# EAGLE design etchasketch (EAGLE 9.6.2)
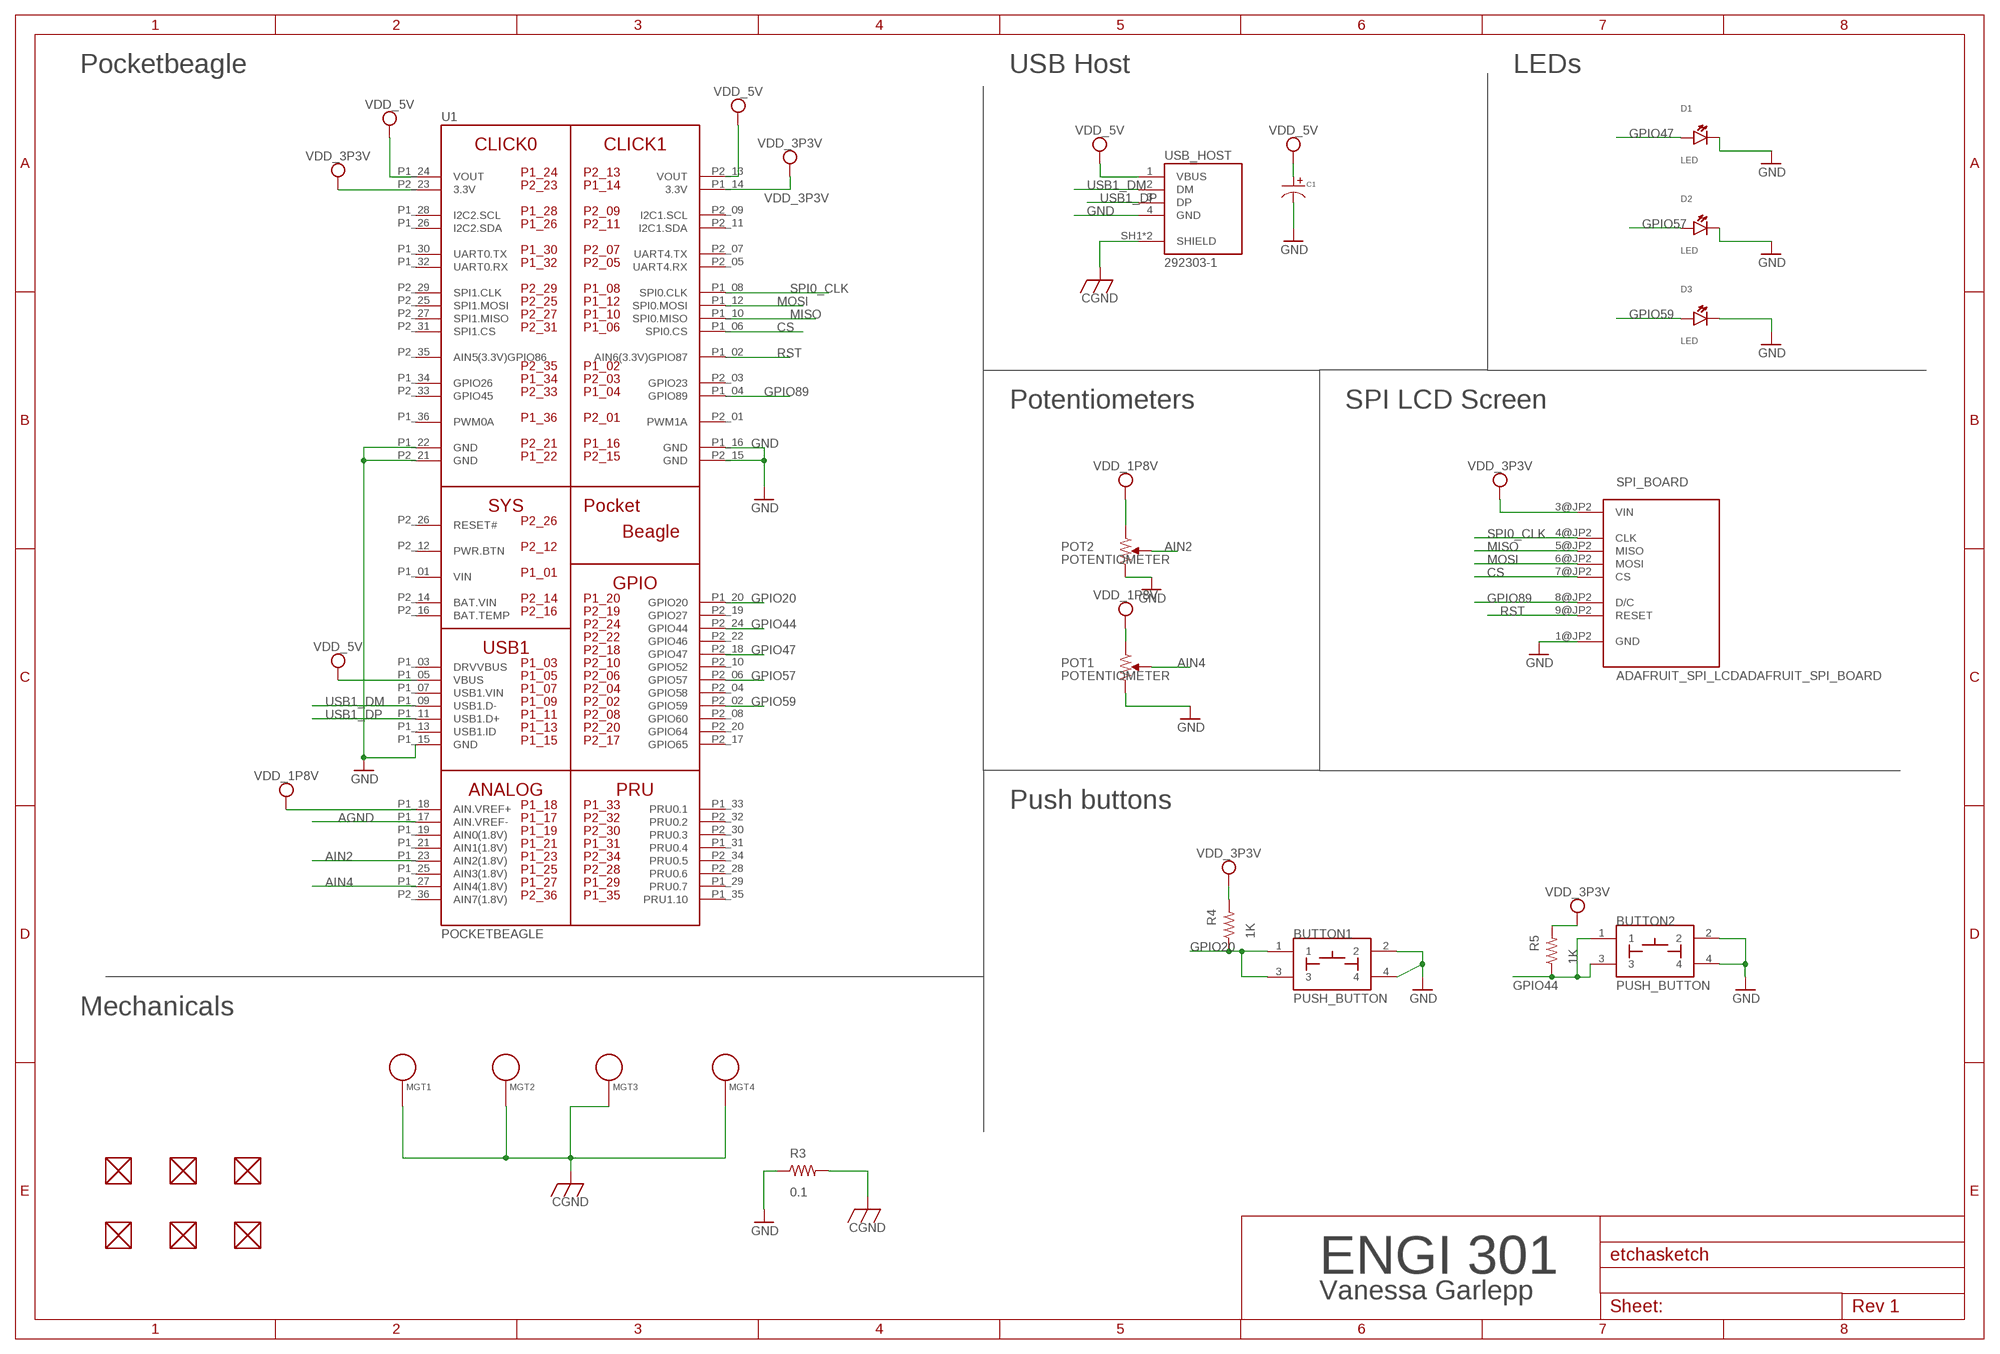
[diagram p0: schematic, sheet 1]

## Parts
BUTTON1  PUSH_BUTTON  [BUTTON_12.5MM]
BUTTON2  PUSH_BUTTON  [BUTTON_12.5MM]
C1  CAPACITOR_P_10MM  [CP10MM]
D1  LED  [EIA-STD]
D2  LED  [EIA-STD]
D3  LED  [EIA-STD]
FUD1  FIDUCIAL  [FIDUCIAL_40MIL]
FUD2  FIDUCIAL  [FIDUCIAL_40MIL]
FUD3  FIDUCIAL  [FIDUCIAL_40MIL]
FUD4  FIDUCIAL  [FIDUCIAL_40MIL]
FUD5  FIDUCIAL  [FIDUCIAL_40MIL]
FUD6  FIDUCIAL  [FIDUCIAL_40MIL]
MGT1  MOUNTING_HOLE  [MOUNTING_HOLE]
MGT2  MOUNTING_HOLE  [MOUNTING_HOLE]
MGT3  MOUNTING_HOLE  [MOUNTING_HOLE]
MGT4  MOUNTING_HOLE  [MOUNTING_HOLE]
POT1  POTENTIOMETER  [POT-PO90S]
POT2  POTENTIOMETER  [POT-PO90S]
R3  0.1  R_R0603  [R0603]
R4  1K  R_R0402  [R0402]
R5  1K  R_R0402  [R0402]
SPI_BOARD  ADAFRUIT_SPI_LCDADAFRUIT_SPI_BOARD  [ADAFRUIT_SPI_BOARD]
U1  POCKETBEAGLE  [POCKETBEAGLE]
USB_HOST  292303-1  [TE_292303-1]

## Nets
AGND: U1.P1_17(AIN.VREF-)
AIN2: POT2.S U1.P1_23(AIN2(1.8V))
AIN4: POT1.S U1.P1_27(AIN4(1.8V))
CGND [New Class]: MGT1.P$1 MGT2.P$1 MGT3.P$1 MGT4.P$1 R3.2 USB_HOST.SH1(SHIELD) USB_HOST.SH2(SHIELD)
CS: SPI_BOARD.7@JP2(CS) U1.P1_06(SPI0.CS)
GND: BUTTON1.2 BUTTON1.4 BUTTON2.2 BUTTON2.4 C1.P$2 D1.CATHODE D2.CATHODE D3.CATHODE POT1.CW POT2.CW R3.1 SPI_BOARD.1@JP2(GND) U1.P1_15(GND) U1.P1_16(GND) U1.P1_22(GND) U1.P2_15(GND) U1.P2_21(GND) USB_HOST.4(GND)
GPIO20: BUTTON1.1 BUTTON1.3 R4.1 U1.P1_20(GPIO20)
GPIO44: BUTTON2.1 BUTTON2.3 R5.1 U1.P2_24(GPIO44)
GPIO47: D1.ANODE U1.P2_18(GPIO47)
GPIO57: D2.ANODE U1.P2_06(GPIO57)
GPIO59: D3.ANODE U1.P2_02(GPIO59)
GPIO89: SPI_BOARD.8@JP2(D/C) U1.P1_04(GPIO89)
MISO: SPI_BOARD.5@JP2(MISO) U1.P1_10(SPI0.MISO)
MOSI: SPI_BOARD.6@JP2(MOSI) U1.P1_12(SPI0.MOSI)
RST: SPI_BOARD.9@JP2(RESET) U1.P1_02(AIN6(3.3V)GPIO87)
SPI0_CLK: SPI_BOARD.4@JP2(CLK) U1.P1_08(SPI0.CLK)
USB1_DM: U1.P1_09(USB1.D-) USB_HOST.2(DM)
USB1_DP: U1.P1_11(USB1.D+) USB_HOST.3(DP)
VDD_1P8V: POT1.CCW POT2.CCW U1.P1_18(AIN.VREF+)
VDD_3P3V: R4.2 R5.2 SPI_BOARD.3@JP2(VIN) U1.P1_14(3.3V) U1.P2_23(3.3V)
VDD_5V: C1.P$1 U1.P1_05(VBUS) U1.P1_24(VOUT) U1.P2_13(VOUT) USB_HOST.1(VBUS)
Unconnected: FUD1.P$1 FUD2.P$1 FUD3.P$1 FUD4.P$1 FUD5.P$1 FUD6.P$1 U1.P1_03(DRVVBUS) U1.P1_07(USB1.VIN) U1.P1_13(USB1.ID) U1.P1_19(AIN0(1.8V)) U1.P1_21(AIN1(1.8V)) U1.P1_25(AIN3(1.8V)) U1.P1_26(I2C2.SDA) U1.P1_28(I2C2.SCL) U1.P1_29(PRU0.7) U1.P1_30(UART0.TX) U1.P1_31(PRU0.4) U1.P1_32(UART0.RX) U1.P1_33(PRU0.1) U1.P1_34(GPIO26) U1.P1_35(PRU1.10) U1.P1_36(PWM0A) U1.P2_01(PWM1A) U1.P2_03(GPIO23) U1.P2_04(GPIO58) U1.P2_05(UART4.RX) U1.P2_07(UART4.TX) U1.P2_08(GPIO60) U1.P2_09(I2C1.SCL) U1.P2_10(GPIO52) U1.P2_11(I2C1.SDA) U1.P2_12(PWR.BTN) U1.P2_16(BAT.TEMP) U1.P2_17(GPIO65) U1.P2_19(GPIO27) U1.P2_20(GPIO64) U1.P2_22(GPIO46) U1.P2_25(SPI1.MOSI) U1.P2_26(RESET#) U1.P2_27(SPI1.MISO) U1.P2_28(PRU0.6) U1.P2_29(SPI1.CLK) U1.P2_30(PRU0.3) U1.P2_31(SPI1.CS) U1.P2_32(PRU0.2) U1.P2_33(GPIO45) U1.P2_34(PRU0.5) U1.P2_35(AIN5(3.3V)GPIO86) U1.P2_36(AIN7(1.8V))

## Notes on the sheet
- Pocketbeagle | USB Host | LEDs
- Potentiometers | SPI LCD Screen
- Push buttons
- Mechanicals
- ENGI 301
- Vanessa Garlepp

## Power pins joined to a net without a drawn wire
BAT.VIN: U1.P2_14(BAT.VIN)
VIN: U1.P1_01(VIN)

## Library data of the parts
BUTTON1 BUTTON2 = pcb_garlepp:PUSH_BUTTON
C1 = pcb_garlepp:CAPACITOR_P: Library: MF_Passives Description: Device for Polarized Capacitors. Manufacture part number (MPN), Voltage Rating, and Tolerance can be added via Attributes. Check https://factory.macrofab.com/parts for the house parts list.; POPULATE: 1
D1-D3 = pcb_garlepp:LED: EIA-STD LED, LTST-C191TBKT
FUD1-FUD6 = pcb_garlepp:FIDUCIAL
MGT1-MGT4 = pcb_garlepp:MOUNTING_HOLE: Chassis Mounting Hole w/GND connection ability
POT1 POT2 = pcb_garlepp:POTENTIOMETER: Potentiometer - Examples: P090S-14T20BR10K (987-1277-ND)
R3-R5 = pcb_garlepp:R_: RESISTOR, American symbol
SPI_BOARD = pcb_garlepp:ADAFRUIT_SPI_LCD: Adafruit 2.8" TFT SPI LCD Display: https://github.com/adafruit/2.8-TFT-Breakout-PCB
U1 = pcb_garlepp:POCKETBEAGLE
USB_HOST = pcb_garlepp:292303-1: CONN USB RECEPT R/A TYPE A 4POS Check availability <https://pricing.snapeda.com/parts/292303-1/TE%20Connectivity/view-part?ref=eda>; AVAILABILITY: In Stock; CENTERLINE_PITCH: 2 mm[.078 in]; COMMENT: 292303-1; DESCRIPTION: Conn; Data; USB; Recept; 2.0; 4 Pos; 1 Port; Rt Angle; A Ser; Tin over Copper; EU_ROHS_COMPLIANCE: Compliant; MF: TE Connectivity; MP: 292303-1; NUMBER_OF_POSITIONS: 4; PACKAGE: None; PRICE: None; PRODUCT_TYPE: Connector; PURCHASE-URL: https://pricing.snapeda.com/search/part/292303-1/?ref=eda

## Board
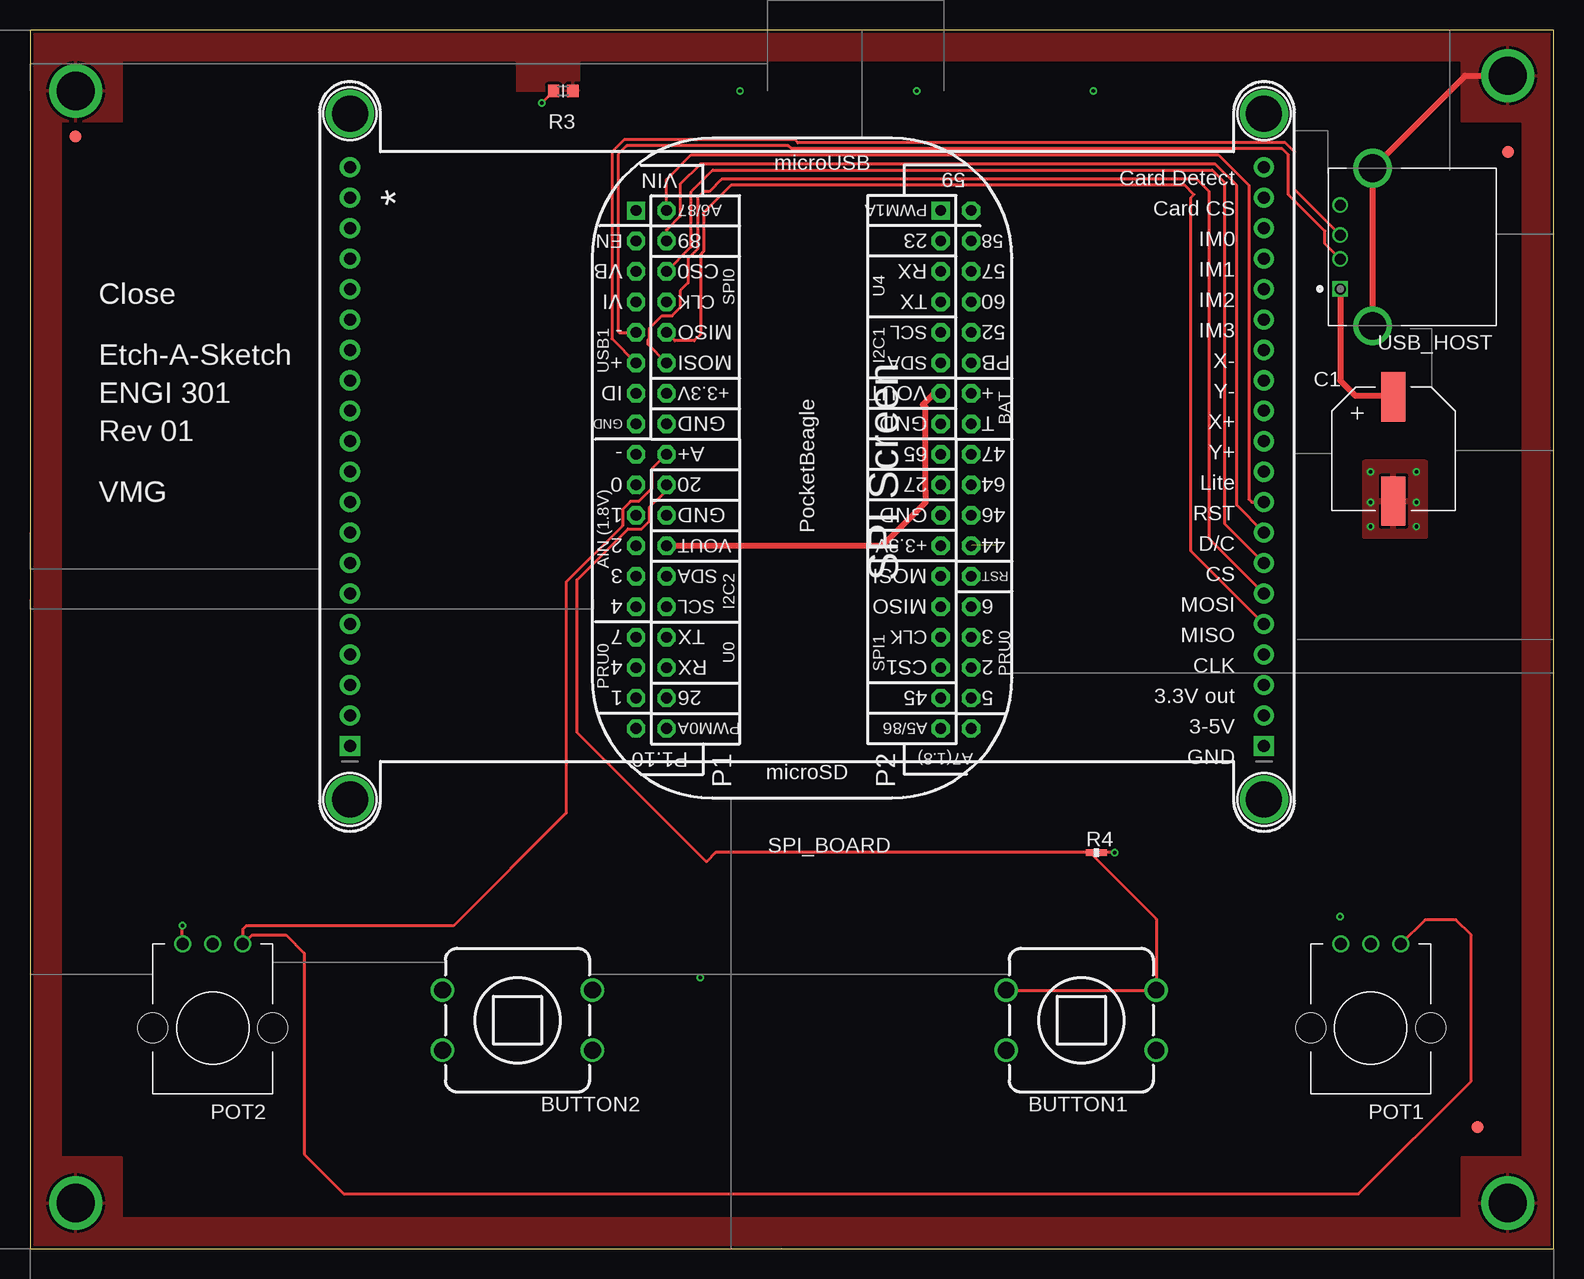
[diagram p1: board, top side]
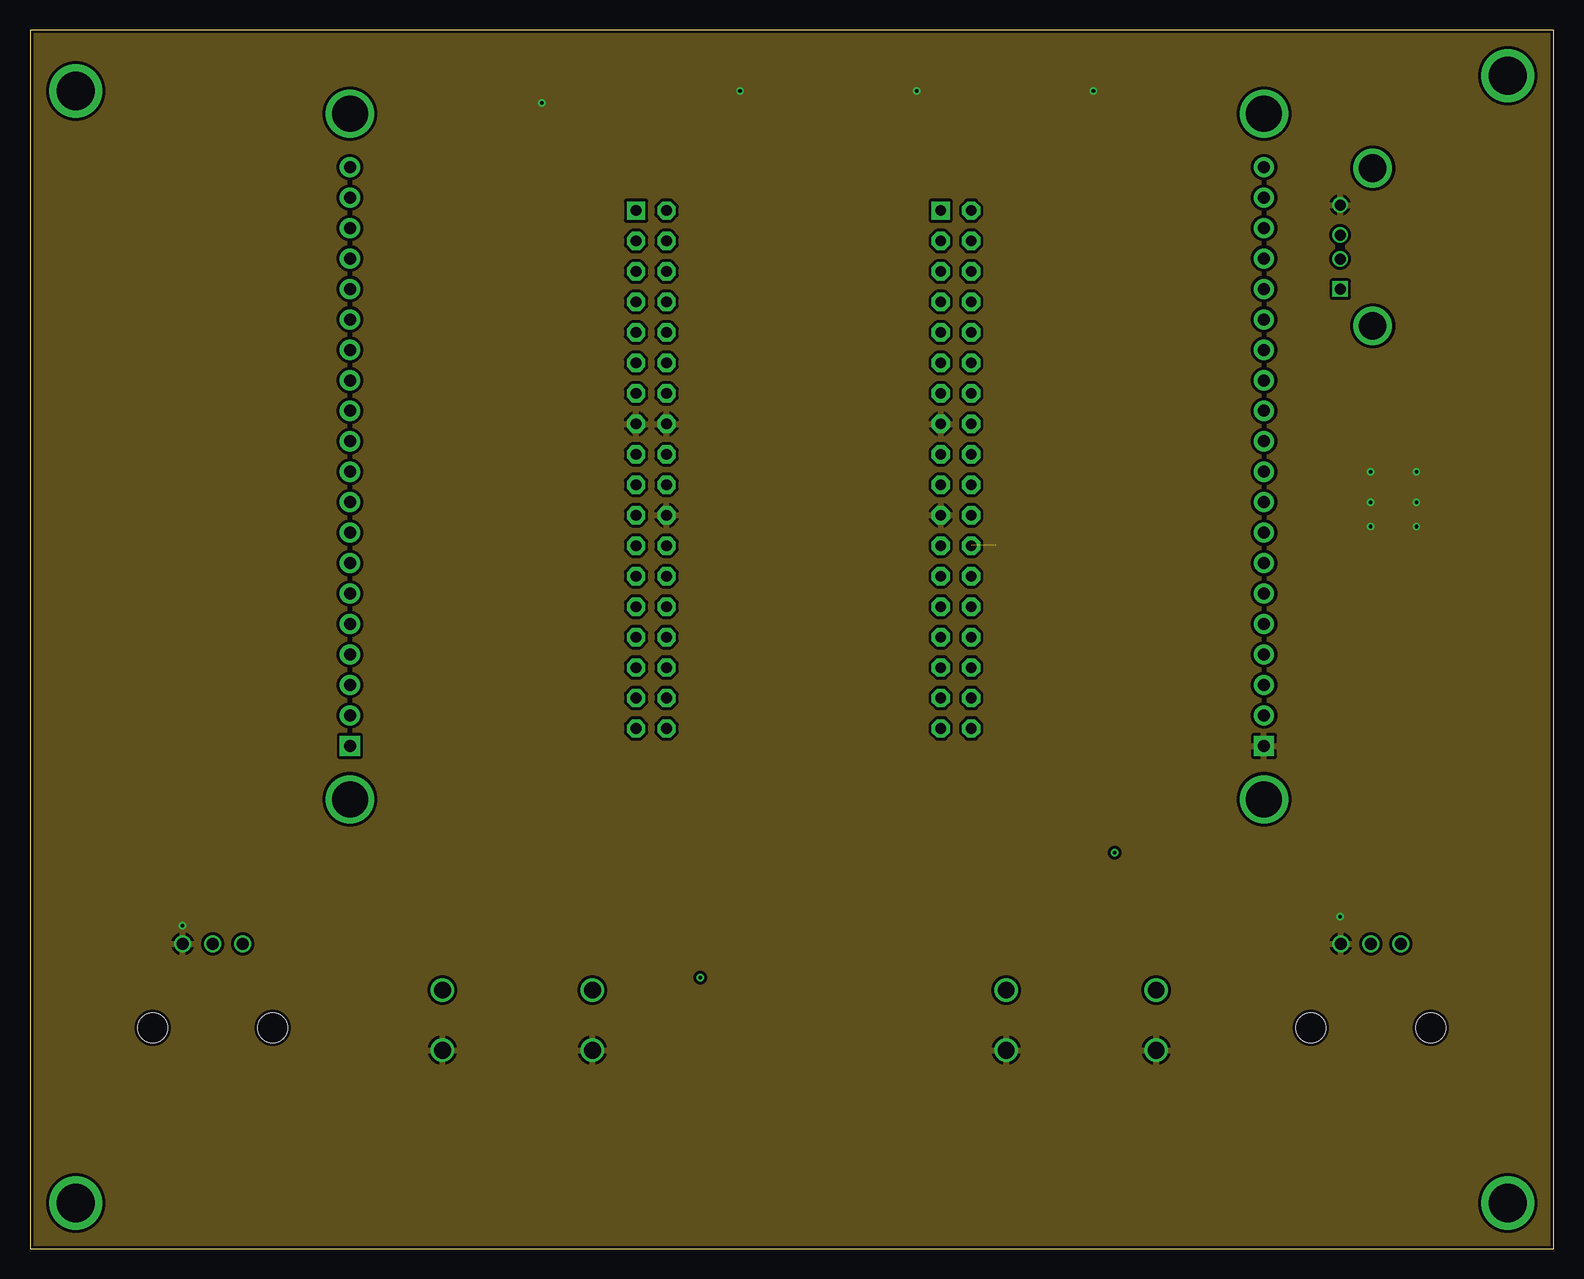
[diagram p2: board, inner layer Route2]
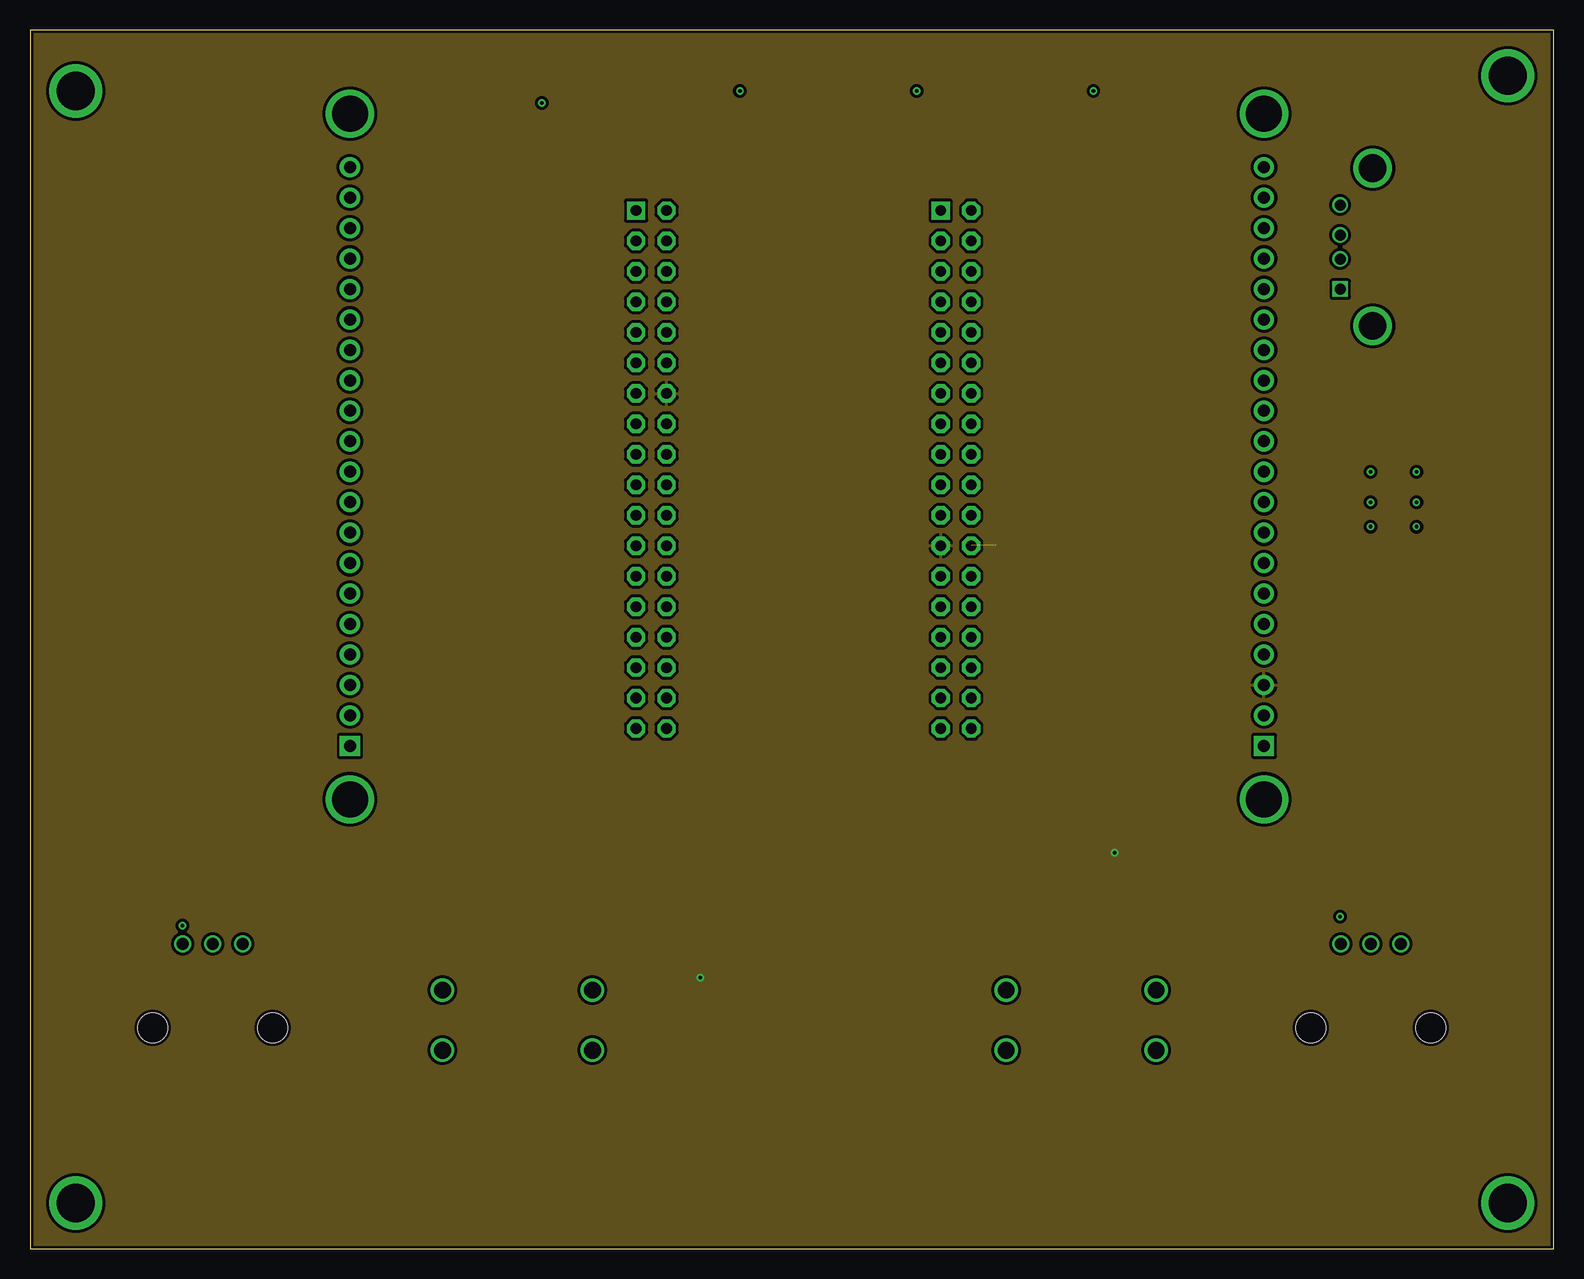
[diagram p3: board, inner layer Route15]
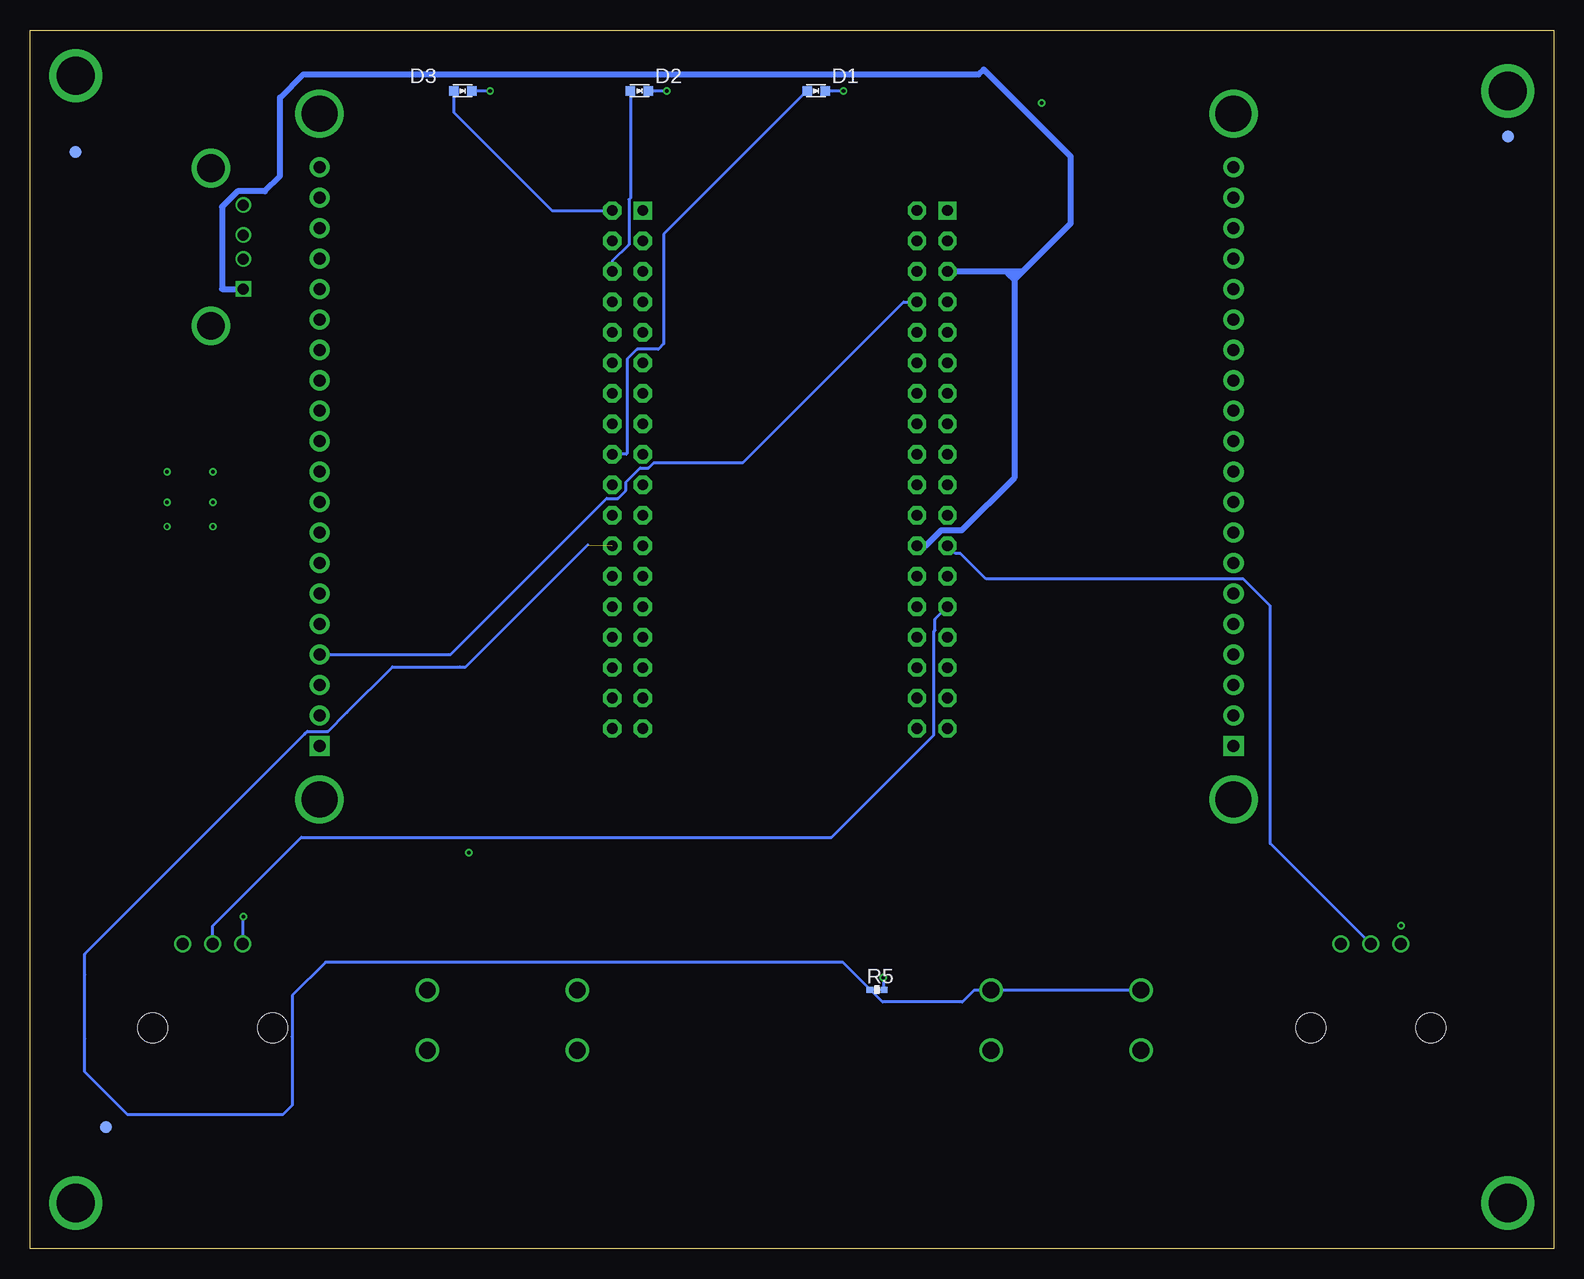
[diagram p4: board, bottom side, seen from below]

Size 127 x 101.6 mm. Coordinates in mm from the lower left corner, seen from the top.
Outline: 0,0 127,0 127,101.6 0,101.6 0,0
Copper layers (1*2*15*16): Top 0.035mm / dielectric 0.23mm / Route2 0.035mm / dielectric 0.93mm / Route15 0.035mm / dielectric 0.23mm / Bottom 0.035mm
Design rules "ENGI301_4lyr": minimum track width 10mil, minimum drill 12mil, track to track 10mil, track to pad 10mil, pad to pad 10mil, via to via 10mil, smd to smd 10mil, copper to edge 10mil, drill to drill 12mil, minimum pad ring 6mil, minimum via ring 6mil, stop-mask expansion 3mil, vias tented up to drill 25mil, thermal gap 10mil

### Footprints (pad centres in the part's own frame; a part is rotated, then mirrored left to right if it is on the bottom)
BUTTON_12.5MM = drill 1.4: 1 -6.25,2.5; 2 -6.25,-2.5; 3 6.25,2.5; 4 6.25,-2.5
CP10MM = smd 2 x 4.1: P$1 0,-4.35; P$2 0,4.35
EIA-STD = smd 0.8 x 0.8: ANODE -0.75,0; CATHODE 0.75,0
FIDUCIAL_40MIL = smd 1.016 x 1.016: P$1 0,0
MOUNTING_HOLE = drill 3.175 pad 4.445: P$1 0,0
POT-PO90S = drill 1: CCW -2.5,0; CW 2.5,0; S 0,0 | hole 2.5: -5,7; 5,7
R0603 = smd 0.95 x 1.031: 1 -0.8,0; 2 0.8,0
R0402 = smd 0.61 x 0.508: 1 -0.559,0; 2 0.559,0
ADAFRUIT_SPI_BOARD = drill 1 pad 1.676 square: 1@JP1 -24.13,38.1; 1@JP2 -24.13,-38.1 | drill 1 pad 1.676: 2@JP1 -21.59,38.1; 2@JP2 -21.59,-38.1; 3@JP1 -19.05,38.1; 3@JP2 -19.05,-38.1; 4@JP1 -16.51,38.1; 4@JP2 -16.51,-38.1; 5@JP1 -13.97,38.1; 5@JP2 -13.97,-38.1; 6@JP1 -11.43,38.1; 6@JP2 -11.43,-38.1; 7@JP1 -8.89,38.1; 7@JP2 -8.89,-38.1; 8@JP1 -6.35,38.1; 8@JP2 -6.35,-38.1; 9@JP1 -3.81,38.1; 9@JP2 -3.81,-38.1; 10@JP1 -1.27,38.1; 10@JP2 -1.27,-38.1; 11@JP1 1.27,38.1; 11@JP2 1.27,-38.1; 12@JP1 3.81,38.1; 12@JP2 3.81,-38.1; 13@JP1 6.35,38.1; 13@JP2 6.35,-38.1; 14@JP1 8.89,38.1; 14@JP2 8.89,-38.1; 15@JP1 11.43,38.1; 15@JP2 11.43,-38.1; 16@JP1 13.97,38.1; 16@JP2 13.97,-38.1; 17@JP1 16.51,38.1; 17@JP2 16.51,-38.1; 18@JP1 19.05,38.1; 18@JP2 19.05,-38.1; 19@JP1 21.59,38.1; 19@JP2 21.59,-38.1; 20@JP1 24.13,38.1; 20@JP2 24.13,-38.1 | drill 3 pad 3.6: P$1@U$7 -28.575,-38.1; P$1@U$15 28.575,-38.1; P$1@U$16 -28.575,38.1; P$1@U$17 28.575,38.1
POCKETBEAGLE = drill 0.889 pad 1.524 square: P1_01 5.91,3.53; P2_01 5.91,28.93 | drill 0.889 pad 1.524 octagon: P1_02 5.91,6.07; P1_03 8.45,3.53; P1_04 8.45,6.07; P1_05 10.99,3.53; P1_06 10.99,6.07; P1_07 13.53,3.53; P1_08 13.53,6.07; P1_09 16.07,3.53; P1_10 16.07,6.07; P1_11 18.61,3.53; P1_12 18.61,6.07; P1_13 21.15,3.53; P1_14 21.15,6.07; P1_15 23.69,3.53; P1_16 23.69,6.07; P1_17 26.23,3.53; P1_18 26.23,6.07; P1_19 28.77,3.53; P1_20 28.77,6.07; P1_21 31.31,3.53; P1_22 31.31,6.07; P1_23 33.85,3.53; P1_24 33.85,6.07; P1_25 36.39,3.53; P1_26 36.39,6.07; P1_27 38.93,3.53; P1_28 38.93,6.07; P1_29 41.47,3.53; P1_30 41.47,6.07; P1_31 44.01,3.53; P1_32 44.01,6.07; P1_33 46.55,3.53; P1_34 46.55,6.07; P1_35 49.09,3.53; P1_36 49.09,6.07; P2_02 5.91,31.47; P2_03 8.45,28.93; P2_04 8.45,31.47; P2_05 10.99,28.93; P2_06 10.99,31.47; P2_07 13.53,28.93; P2_08 13.53,31.47; P2_09 16.07,28.93; P2_10 16.07,31.47; P2_11 18.61,28.93; P2_12 18.61,31.47; P2_13 21.15,28.93; P2_14 21.15,31.47; P2_15 23.69,28.93; P2_16 23.69,31.47; P2_17 26.23,28.93; P2_18 26.23,31.47; P2_19 28.77,28.93; P2_20 28.77,31.47; P2_21 31.31,28.93; P2_22 31.31,31.47; P2_23 33.85,28.93; P2_24 33.85,31.47; P2_25 36.39,28.93; P2_26 36.39,31.47; P2_27 38.93,28.93; P2_28 38.93,31.47; P2_29 41.47,28.93; P2_30 41.47,31.47; P2_31 44.01,28.93; P2_32 44.01,31.47; P2_33 46.55,28.93; P2_34 46.55,31.47; P2_35 49.09,28.93; P2_36 49.09,31.47
TE_292303-1 = drill 0.92 square: 1 0,0 | drill 0.92: 2 2.5,0; 3 4.5,0; 4 7,0 | drill 2.3: SH1 -3.07,-2.71; SH2 10.07,-2.71

### Placement (x,y rotation side)
BUTTON1  87.63,19.05 0 top
BUTTON2  40.64,19.05 0 top
C1  113.67,66.67 180 top
D1  61.47,96.52 0 bottom
D2  76.2,96.52 0 bottom
D3  90.93,96.52 0 bottom
FUD1  3.81,92.71 0 top
FUD2  120.65,10.16 0 bottom
FUD3  123.19,91.44 0 top
FUD4  3.81,92.71 0 bottom
FUD5  123.19,91.44 0 bottom
FUD6  120.65,10.16 0 top
MGT1  123.19,97.79 0 top
MGT2  123.19,3.81 0 top
MGT3  3.81,3.81 0 top
MGT4  3.81,96.52 0 top
POT1  111.76,25.4 180 top
POT2  15.24,25.4 180 top
R3  44.45,96.52 0 top
R4  88.9,33.02 0 top
R5  56.39,21.59 0 bottom
SPI_BOARD  64.77,66.04 90 top
U1  46.99,92.46 270 top
USB_HOST  109.22,80.01 90 top

### Tracks (layer width: path | path; a pad name or v marks a point on that pad's centre or on a via)
AIN2
  Bottom 0.254: POT2.S 23.62,33.78 23.62,53.59 25.86,55.83 47.31,55.83 49.45,57.97 49.88,57.97 U1.P1_23
AIN4
  Bottom 0.254: POT1.S 111.76,26.92 104.39,34.29 60.2,34.29 51.66,42.83 51.66,51.46 51.56,51.56 51.56,52.48 U1.P1_27
CGND
  Top 0.508: 121.83,96.42 MGT1.P$1 119.64,97.79 USB_HOST.SH2 USB_HOST.SH1
  pour Top: -2.54,-2.54 -2.54,50.8 2.54,50.8 2.54,7.62 7.62,7.62 7.62,2.54 119.38,2.54 119.38,7.62 124.46,7.62 124.46,50.8 129.54,50.8 129.54,-2.54
  pour Top: -2.54,50.8 -2.54,104.14 129.54,104.14 129.54,50.8 124.46,50.8 124.46,93.98 119.38,93.98 119.38,99.06 45.72,99.06 45.72,96.52 40.64,96.52 40.64,99.06 7.62,99.06 7.62,93.98 2.54,93.98 2.54,50.8
CS
  Top 0.254: U1.P1_06 55.12,83.52 55.12,88.14 56.9,89.92 98.55,89.92 99.57,88.9 99.57,60.45 SPI_BOARD.7@JP2 | SPI_BOARD.7@JP2 103.12,56.9 103.38,56.9 103.12,57.15 SPI_BOARD.7@JP2
GND  (via drill 0.3 pad 0.61)
  Top 0.254: POT2.CW 12.7,25.44 v12.7,26.92 | R3.1 42.67,95.54 v42.67,95.5
  Bottom 0.254: POT1.CW 109.22,25.44 v109.22,27.69 | D1.CATHODE v59.18,96.52 | D2.CATHODE v73.91,96.52 | D3.CATHODE v88.65,96.52
  other vias: 111.76,64.77 111.76,62.23 111.76,60.2 115.57,60.2 115.57,62.23 115.57,64.77
  pour Route2: -10.16,111.76 137.16,111.76 137.16,-10.16 -10.16,-10.16
  pour Top: 111.25,65.53 111.25,59.44 116.33,59.44 116.33,65.53
GPIO20
  Top 0.254: BUTTON1.1 BUTTON1.3 93.88,27.48 R4.1 57.15,33.02 56.39,32.26 45.59,43.05 45.59,55.75 49.84,60 50.99,60 51.66,60.67 51.66,61.82 53.06,63.22 U1.P1_20
GPIO44  (1 unrouted)
  Bottom 0.254: BUTTON2.1 BUTTON2.3 47.24,21.55 48.3,21.55 49.28,20.57 55.93,20.57 R5.1 59.23,23.88 102.36,23.88 105.13,21.11 105.13,17.72 105.16,17.7 105.16,11.94 105.92,11.18 118.87,11.18 122.43,14.73 122.43,17.53 122.43,22.86 122.43,24.57 104.09,42.91 103.87,43.13 102.16,43.13 100.58,44.7 96.77,48.51 91.19,48.51 90.68,48.51 80.52,58.67
GPIO47
  Bottom 0.254: D1.ANODE 74.17,84.57 74.17,75.44 74.62,74.99 76.39,74.99 77.21,74.17 77.22,74.17 77.22,66.29 77.28,66.23 U1.P2_18
GPIO57
  Bottom 0.254: D2.ANODE 76.95,87.58 77.06,87.47 77.06,83.72 78.46,82.32 U1.P2_06
GPIO59
  Bottom 0.254: D3.ANODE 91.68,94.73 83.5,86.55 U1.P2_02
GPIO89
  Top 0.254: SPI_BOARD.8@JP2 100.58,61.98 100.58,88.65 98.81,90.42 55.88,90.42 54.2,88.75 54.2,86.07 53.06,84.93 U1.P1_04
MISO
  Top 0.254: SPI_BOARD.5@JP2 96.77,58.17 96.77,87.63 97.03,87.88 96.27,88.65 58.42,88.65 56.13,86.36 56.13,83.1 55.88,82.85 55.88,76.2 55.37,75.69 53.75,75.69 U1.P1_10
MOSI
  Top 0.254: SPI_BOARD.6@JP2 98.3,59.18 98.3,88.14 97.28,89.15 57.66,89.15 56.64,88.14 56.13,88.14 55.63,87.63 55.63,83.31 54.86,82.55 54.86,80.52 54.2,79.86 54.2,78.45 53.53,77.78 52.7,77.78 51.66,76.74 51.66,75.91 51.5,75.75 51.5,75.4 U1.P1_12
RST
  Top 0.254: U1.P1_02 53.06,89.13 55.12,91.19 99.06,91.19 101.6,88.65 101.6,62.48 101.85,62.23 SPI_BOARD.9@JP2
SPI0_CLK
  Bottom 0.254: SPI_BOARD.4@JP2 91.95,49.53 78.94,62.54 77.99,62.54 77.32,63.21 77.32,63.91 76.14,65.08 75.45,65.08 75,65.53 67.56,65.53 54.17,78.93 U1.P1_08
USB1_DM
  Top 0.254: USB_HOST.2 107.95,83.78 107.95,84.84 104.9,87.88 104.9,91.19 104.39,91.69 63.5,91.69 63.25,91.95 49.74,91.95 49.02,91.23 49.02,76.45 49.09,76.39 U1.P1_09
USB1_DP
  Top 0.254: USB_HOST.3 105.41,88.32 105.41,91.44 104.65,92.2 64.01,92.2 63.75,92.46 49.53,92.46 48.51,91.44 48.51,75.85 U1.P1_11
  Bottom 0.254: 50.73,73.85 U1.P1_11
VDD_1P8V
  Top 0.254: POT1.CCW 116.29,27.43 118.87,27.43 120.14,26.16 120.14,13.97 110.74,4.57 26.16,4.57 22.86,7.87 22.86,24.64 21.34,26.16 18.5,26.16 POT2.CCW 17.74,26.63 18.03,26.92 35.31,26.92 44.7,36.32 44.7,55.58 49.38,60.26 49.38,61.62 50.05,62.29 50.74,62.29 51.82,63.37 51.82,64.98 U1.P1_18
VDD_3P3V  (via drill 0.3 pad 0.61)
  Top 0.254: v90.42,33.02 R4.2
  Bottom 0.254: R5.2 55.83,22.55 v55.88,22.61
  pour Route15: -15.24,-10.16 -15.24,116.84 142.24,116.84 142.24,-15.24 -15.24,-15.24
VDD_5V
  Top 0.508: USB_HOST.1 109.22,72.39 110.49,71.12 114.3,71.12 114.2,71.03 C1.P$1 | U1.P1_24 71.05,58.61 74.68,62.23 74.68,63.13 74.65,63.16 74.65,70.13 74.42,70.36 75.37,71.31 U1.P2_13
  Bottom 0.508: 44.26,81.47 44.96,81.47 | 44.96,81.47 U1.P1_05 | 44.26,81.47 40.26,85.47 40.26,91.06 47.5,98.3 47.9,97.89 104.23,97.89 106.15,95.97 106.15,89.43 107.42,88.16 109.7,88.16 111,86.86 111,80.01 USB_HOST.1 | 44.96,81.47 44.96,80.77 | 44.96,80.77 44.96,64.26 49.34,59.88 51.05,59.88 52.32,58.61 U1.P1_24 | 44.26,81.47 44.96,80.77 | 44.96,80.77 45.47,81.28

### Text on the board
tPlace: Close | Etch-A-Sketch | ENGI 301 | Rev 01 | VMG